# Altium schematic sheet MCU.SchDoc
size A4; Designer: Zeineb El Arbi; Organization: ORGANIZATION; Address1: ADDRESS 1; Address2: ADDRESS 2; Address3: ADDRESS 3; Address4: ADDRESS 4; Revision: -; SheetNumber: 3; SheetTotal: 5; ENG_APP_DATE: --/--/--; DSN_APP_DATE: --/--/--; CHK_APP_DATE: --/--/--
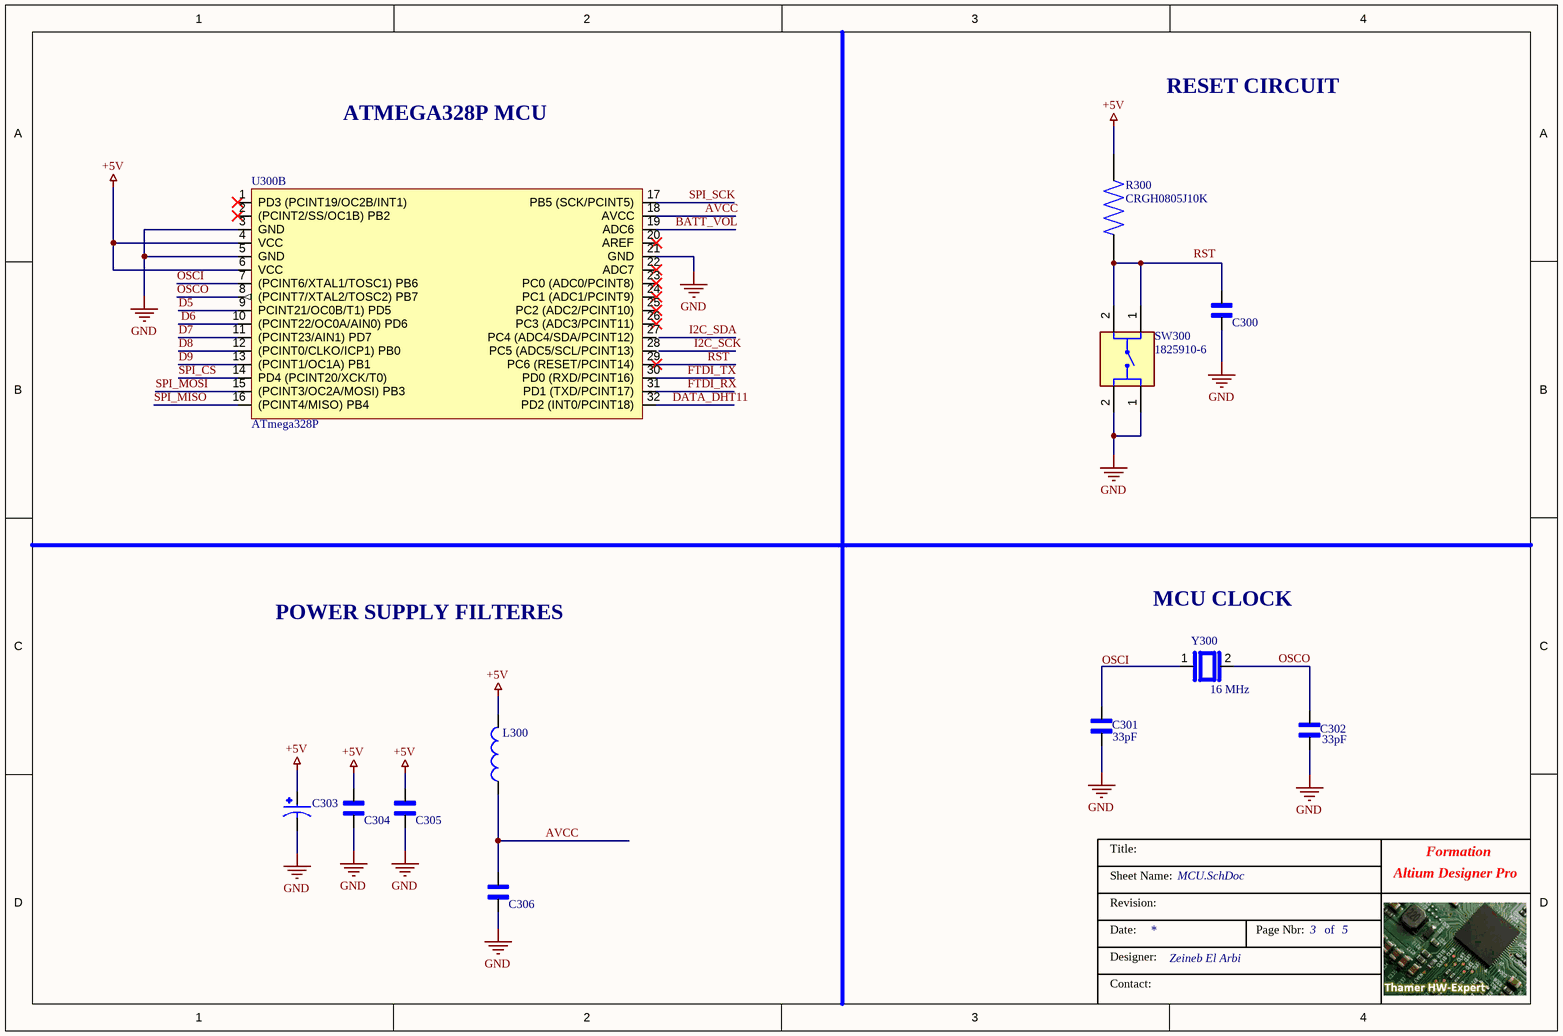
[diagram p0: MCU.SchDoc]

## Parts
C300  GCM21BR71H104KA37K  [CAPC2012X135N]  (value not drawn)
C301  value 33pF  [CAPC2012X100N]  (hidden comment: GRM21A5C2E330JW01D)
C302  value 33pF  [CAPC2012X100N]  (hidden comment: GRM21A5C2E330JW01D)
C303  EEEHB1H4R7AR  [CAP_EEEHB1H4R7AR]  (value not drawn)
C304  GCM21BR71H104KA37K  [CAPC2012X135N]  (value not drawn)
C305  GCM21BR71H104KA37K  [CAPC2012X135N]  (value not drawn)
C306  GCM21BR71H104KA37K  [CAPC2012X135N]  (value not drawn)
L300  LQM21DN100N00D  [INDC2012X105N]  (value not drawn)
R300  CRGH0805J10K  [RESC2012X65N]
SW300  1825910-6  [SW_1825910-6-4]
U300  ATmega328P  [TQFP80P900X900X120-32N]  (part B of 2)
Y300  value 16 MHz  [XTAL_HC49P488W43L1150T466H350]  (hidden comment: HC-49/U-S16000000ABJB)

## Nets
+5V: C303.1 C304.1 C305.1 L300.2 R300.2 U300.4(VCC) U300.6(VCC)
GND: C300.1 C301.1 C302.1 C303.2 C304.2 C305.2 C306.2 SW300.1 SW300.2 U300.3(GND) U300.5(GND) U300.21(GND)
AVCC: C306.1 L300.1 U300.18(AVCC)
BATT_VOL: U300.19(ADC6)
D5: U300.9(PCINT21/OC0B/T1)_PD5)
D6: U300.10((PCINT22/OC0A/AIN0)_PD6)
D7: U300.11((PCINT23/AIN1)_PD7)
D8: U300.12((PCINT0/CLKO/ICP1)_PB0)
D9: U300.13((PCINT1/OC1A)_PB1)
DATA_DHT11: U300.32(PD2_(INT0/PCINT18))
FTDI_RX: U300.31(PD1_(TXD/PCINT17))
FTDI_TX: U300.30(PD0_(RXD/PCINT16))
OSCI: C301.2 U300.7((PCINT6/XTAL1/TOSC1)_PB6) Y300.1
OSCO: C302.2 U300.8((PCINT7/XTAL2/TOSC2)_PB7) Y300.2
RST: U300.29(PC6_(RESET/PCINT14))
SPI_CS: U300.14(PD4_(PCINT20/XCK/T0))
SPI_MISO: U300.16((PCINT4/MISO)_PB4)
SPI_MOSI: U300.15((PCINT3/OC2A/MOSI)_PB3)
SPI_SCK: U300.17(PB5_(SCK/PCINT5))
NetC300_1: C300.1 R300.1 SW300.1 SW300.2

Not connected (* = marked no-connect by the designer): U300 1(PD3_(PCINT19/OC2B/INT1)_)* 2((PCINT2/SS/OC1B)_PB2)* 20(AREF)* 22(ADC7)* 23(PC0_(ADC0/PCINT8))* 24(PC1_(ADC1/PCINT9))* 25(PC2_(ADC2/PCINT10))* 26(PC3_(ADC3/PCINT11))* 27(PC4_(ADC4/SDA/PCINT12)) 28(PC5_(ADC5/SCL/PCINT13))

## Notes on the sheet
- RESET CIRCUIT
- ATMEGA328P MCU
- POWER SUPPLY FILTERES
- MCU CLOCK
- Labels drawn without touching a wire or pin: RST
- Title:
- Formation
- Sheet Name:
- Revision:
- Altium Designer Pro
- Date:
- Designer:
- Contact:
- Page Nbr:
- of

## Library data of the parts
C300 C304-C306 = GCM21BR71H104KA37K: .1UF 50V 10% 080; MF: {'manufacturer': u'Murata'}; Package: None; Price: None; Value: *; MP: GCM21BR71H104KA37K; Availability: Unavailable
C301 C302 = GRM21A5C2E330JW01D: Cap Ceramic 33pF 250V C0G 5% Pad SMD 0805 125C T/R; MF: {'manufacturer': u'Murata'}; Package: None; Price: None; MP: GRM21A5C2E330JW01D; Availability: Unavailable
C303 = EEEHB1H4R7AR: MF: {'manufacturer': u'Panasonic'}; Package: None; Price: None; Value: *; MP: EEEHB1H4R7AR; Availability: Unavailable
L300 = LQM21DN100N00D: Power inductor SMD 0805 10uH; MF: {'manufacturer': u'Murata'}; Package: None; Price: None; Value: *; MP: LQM21DN100N00D; Availability: Unavailable
R300 = CRGH0805J10K: Res Thick Film 0805 10K Ohm 5% 1/3W Â±100ppm/Â°C Molded SMD SMD T/R; MF: {'manufacturer': u'TE Connectivity'}; Package: None; Price: None; Value: *; MP: CRGH0805J10K; Availability: Unavailable
SW300 = 1825910-6: Switch Tactile OFF (ON) SPST Round Button PC Pins 0.05A 24VDC 100000Cycles 1.57N Thru-Hole Loose; MF: {'manufacturer': u'TE Connectivity'}; Package: None; Price: None; Value: *; MP: 1825910-6; Availability: Unavailable
U300 = ATmega328P: 8-bit AVR Microcontroller with 32K Bytes In-System / Programmable Flash
Y300 = HC-49/U-S16000000ABJB: HC49US Series 16 MHz Â±30 ppm 18 pF -20 to +70 Â°C Through Hole AT-CUT Crystal; MF: {'manufacturer': u'Citizen Finedevice Co Ltd'}; Package: None; Price: None; MP: HC-49/U-S16000000ABJB; Availability: Unavailable